# EAGLE schematic plusz-end-card-with-turnstile-mezzanine (EAGLE 9.6.2)

## Sheet 1 of 2: UHF
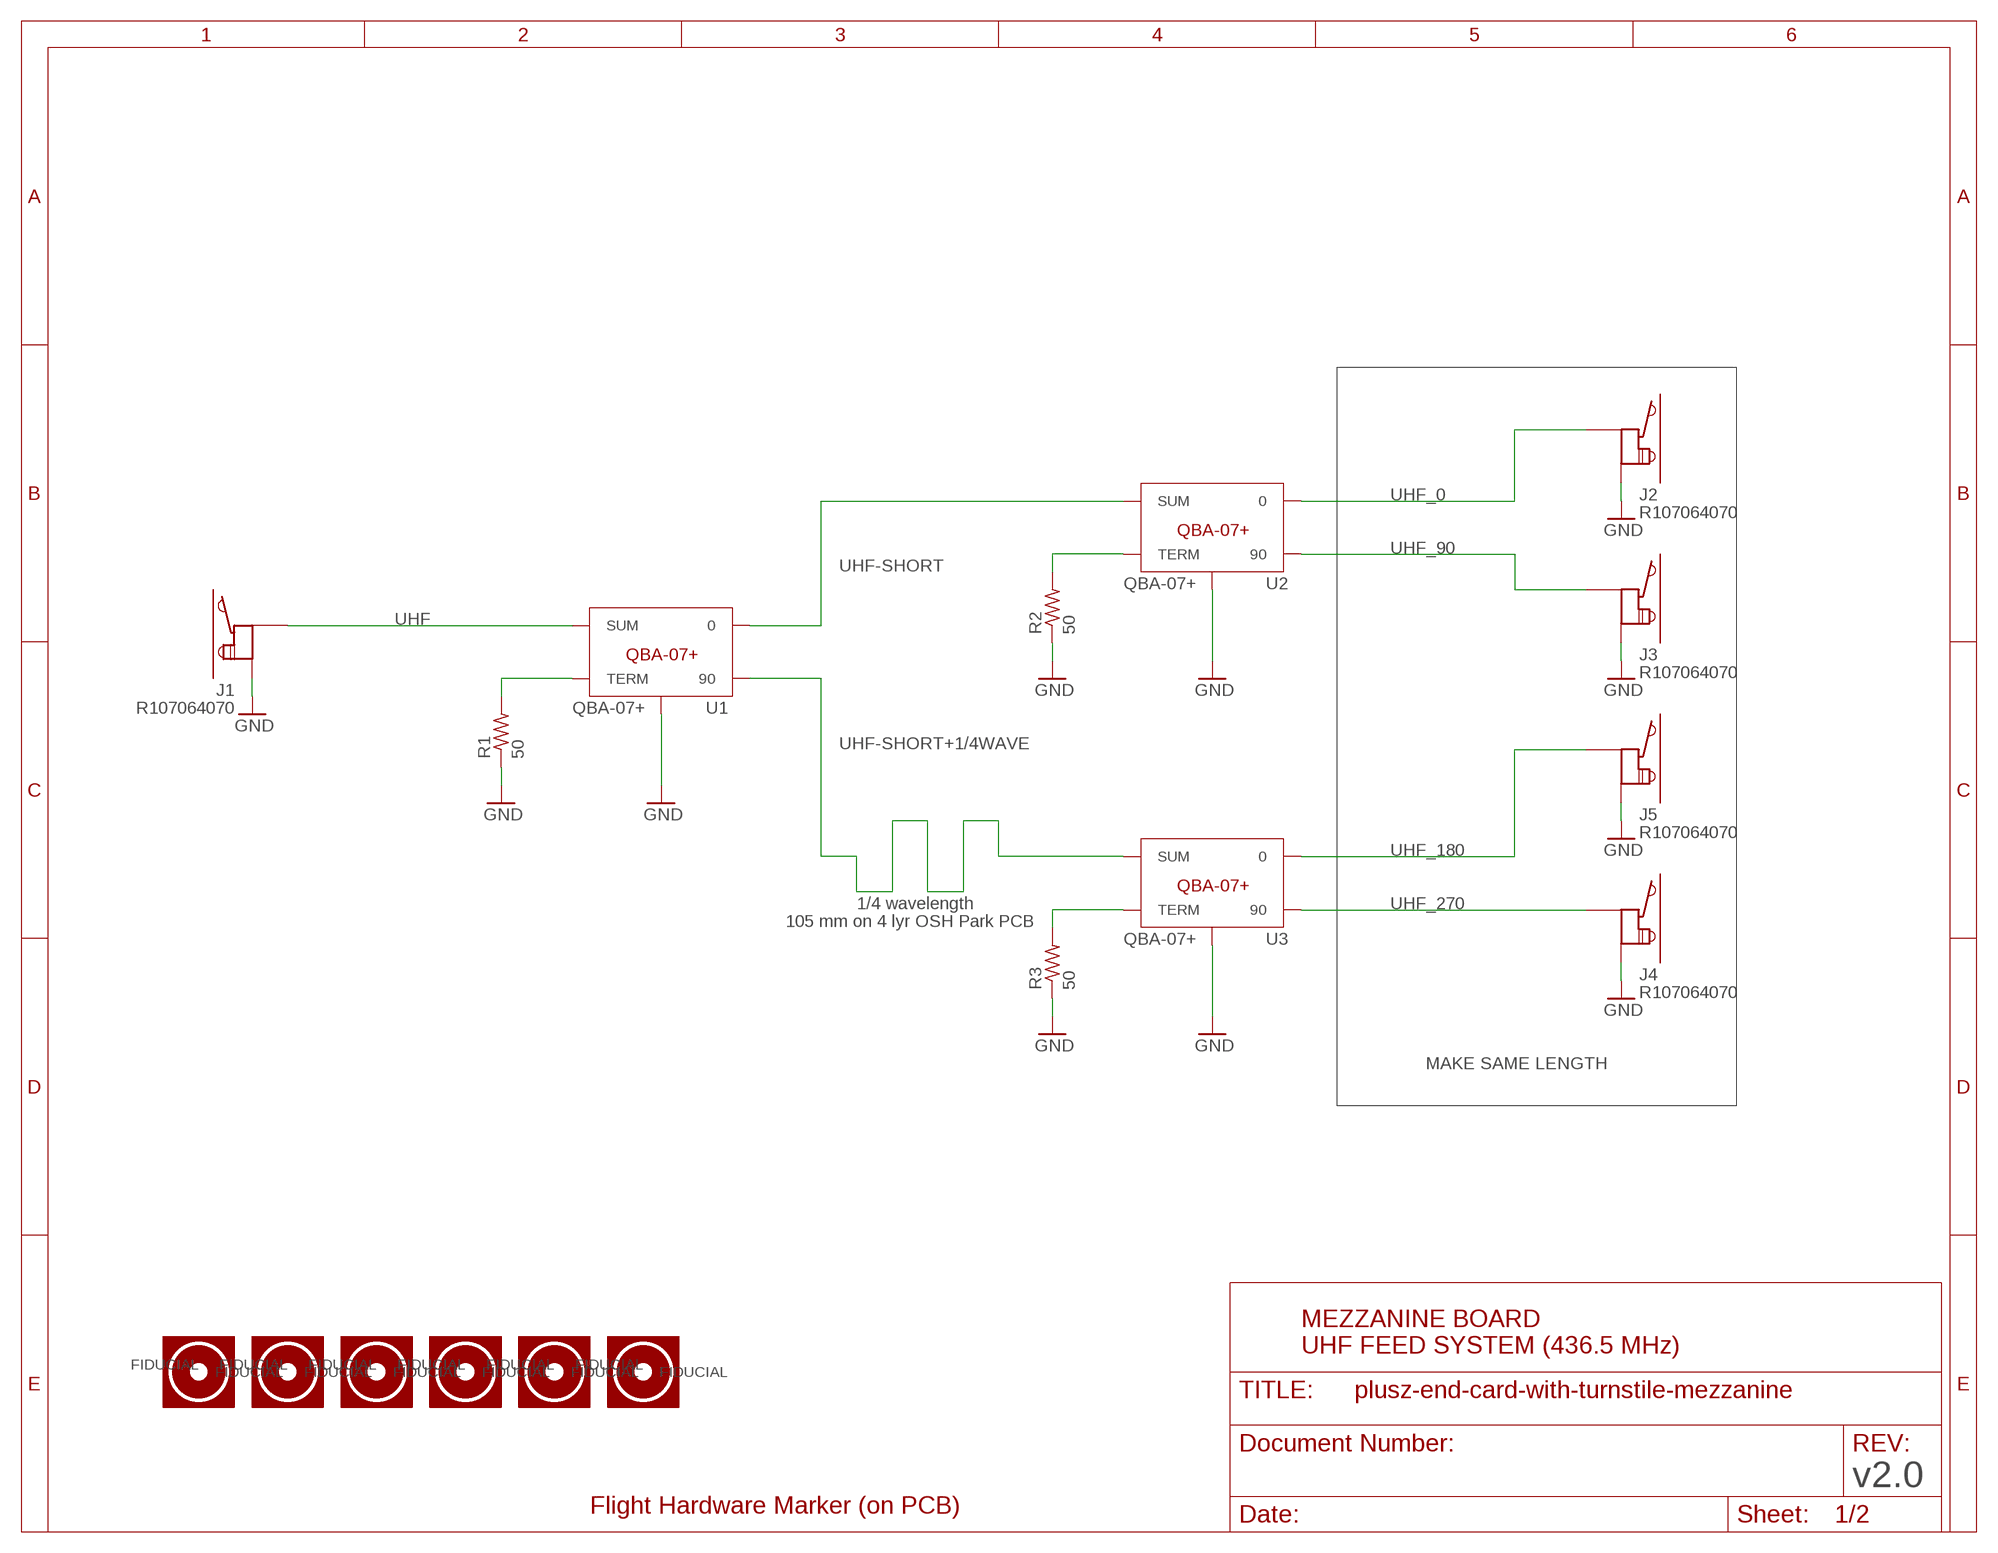
[diagram p0: schematic, sheet 1]

### Parts
FIDUCIAL1  FIDUCIAL-1.0X2.0  [FIDUCIAL-1.0X2.0]
FIDUCIAL2  FIDUCIAL-1.0X2.0  [FIDUCIAL-1.0X2.0]
FIDUCIAL3  FIDUCIAL-1.0X2.0  [FIDUCIAL-1.0X2.0]
FIDUCIAL4  FIDUCIAL-1.0X2.0  [FIDUCIAL-1.0X2.0]
FIDUCIAL6  FIDUCIAL-1.0X2.0  [FIDUCIAL-1.0X2.0]
FIDUCIAL7  FIDUCIAL-1.0X2.0  [FIDUCIAL-1.0X2.0]
J1  R107064070  [R107064070_SOLDER]
J2  R107064070  [R107064070_SOLDER]
J3  R107064070  [R107064070_SOLDER]
J4  R107064070  [R107064070_SOLDER]
J5  R107064070  [R107064070_SOLDER]
R1  50  R-US_0603-C-NOSILK  [.0603-C-NOSILK]
R2  50  R-US_0603-C-NOSILK  [.0603-C-NOSILK]
R3  50  R-US_0603-C-NOSILK  [.0603-C-NOSILK]
U1  QBA-07+  [QBA-07+]
U2  QBA-07+  [QBA-07+]
U3  QBA-07+  [QBA-07+]
U$1  FLIGHMARKERNEW  [FLIGHTMARKER_NEW_BOARDS]

### Nets
GND: J1.P$2 J1.P$3 J2.P$2 J2.P$3 J3.P$2 J3.P$3 J4.P$2 J4.P$3 J5.P$2 J5.P$3 R1.1 R2.1 R3.1 U1.2(GND) U1.3(GND) U1.4(GND) U1.7(GND) U1.8(GND) U1.9(GND) U1.GND-NO-PAD(GND) U2.2(GND) U2.3(GND) U2.4(GND) U2.7(GND) U2.8(GND) U2.9(GND) U2.GND-NO-PAD(GND) U3.2(GND) U3.3(GND) U3.4(GND) U3.7(GND) U3.8(GND) U3.9(GND) U3.GND-NO-PAD(GND) ; also sheet 2
N$3: R1.2 U1.5(TERM)
N$4: R2.2 U2.5(TERM)
N$6: R3.2 U3.5(TERM)
UHF [RF]: J1.P$1 U1.1(SUM)
UHF-SHORT [RF]: U1.6 U2.1(SUM)
UHF-SHORT+1/4WAVE [RF]: U1.10 U3.1(SUM)
UHF_0 [RF]: J2.P$1 U2.6
UHF_90 [RF]: J3.P$1 U2.10
UHF_180 [RF]: J5.P$1 U3.6
UHF_270 [RF]: J4.P$1 U3.10
Unconnected: FIDUCIAL1.FIDUCIAL FIDUCIAL2.FIDUCIAL FIDUCIAL3.FIDUCIAL FIDUCIAL4.FIDUCIAL FIDUCIAL6.FIDUCIAL FIDUCIAL7.FIDUCIAL

### Notes on the sheet
- 1/4 wavelength
- 105 mm on 4 lyr OSH Park PCB
- MAKE SAME LENGTH
- MEZZANINE BOARD
  UHF FEED SYSTEM (436.5 MHz)
- v2.0

## Sheet 2 of 2: L1 BAND
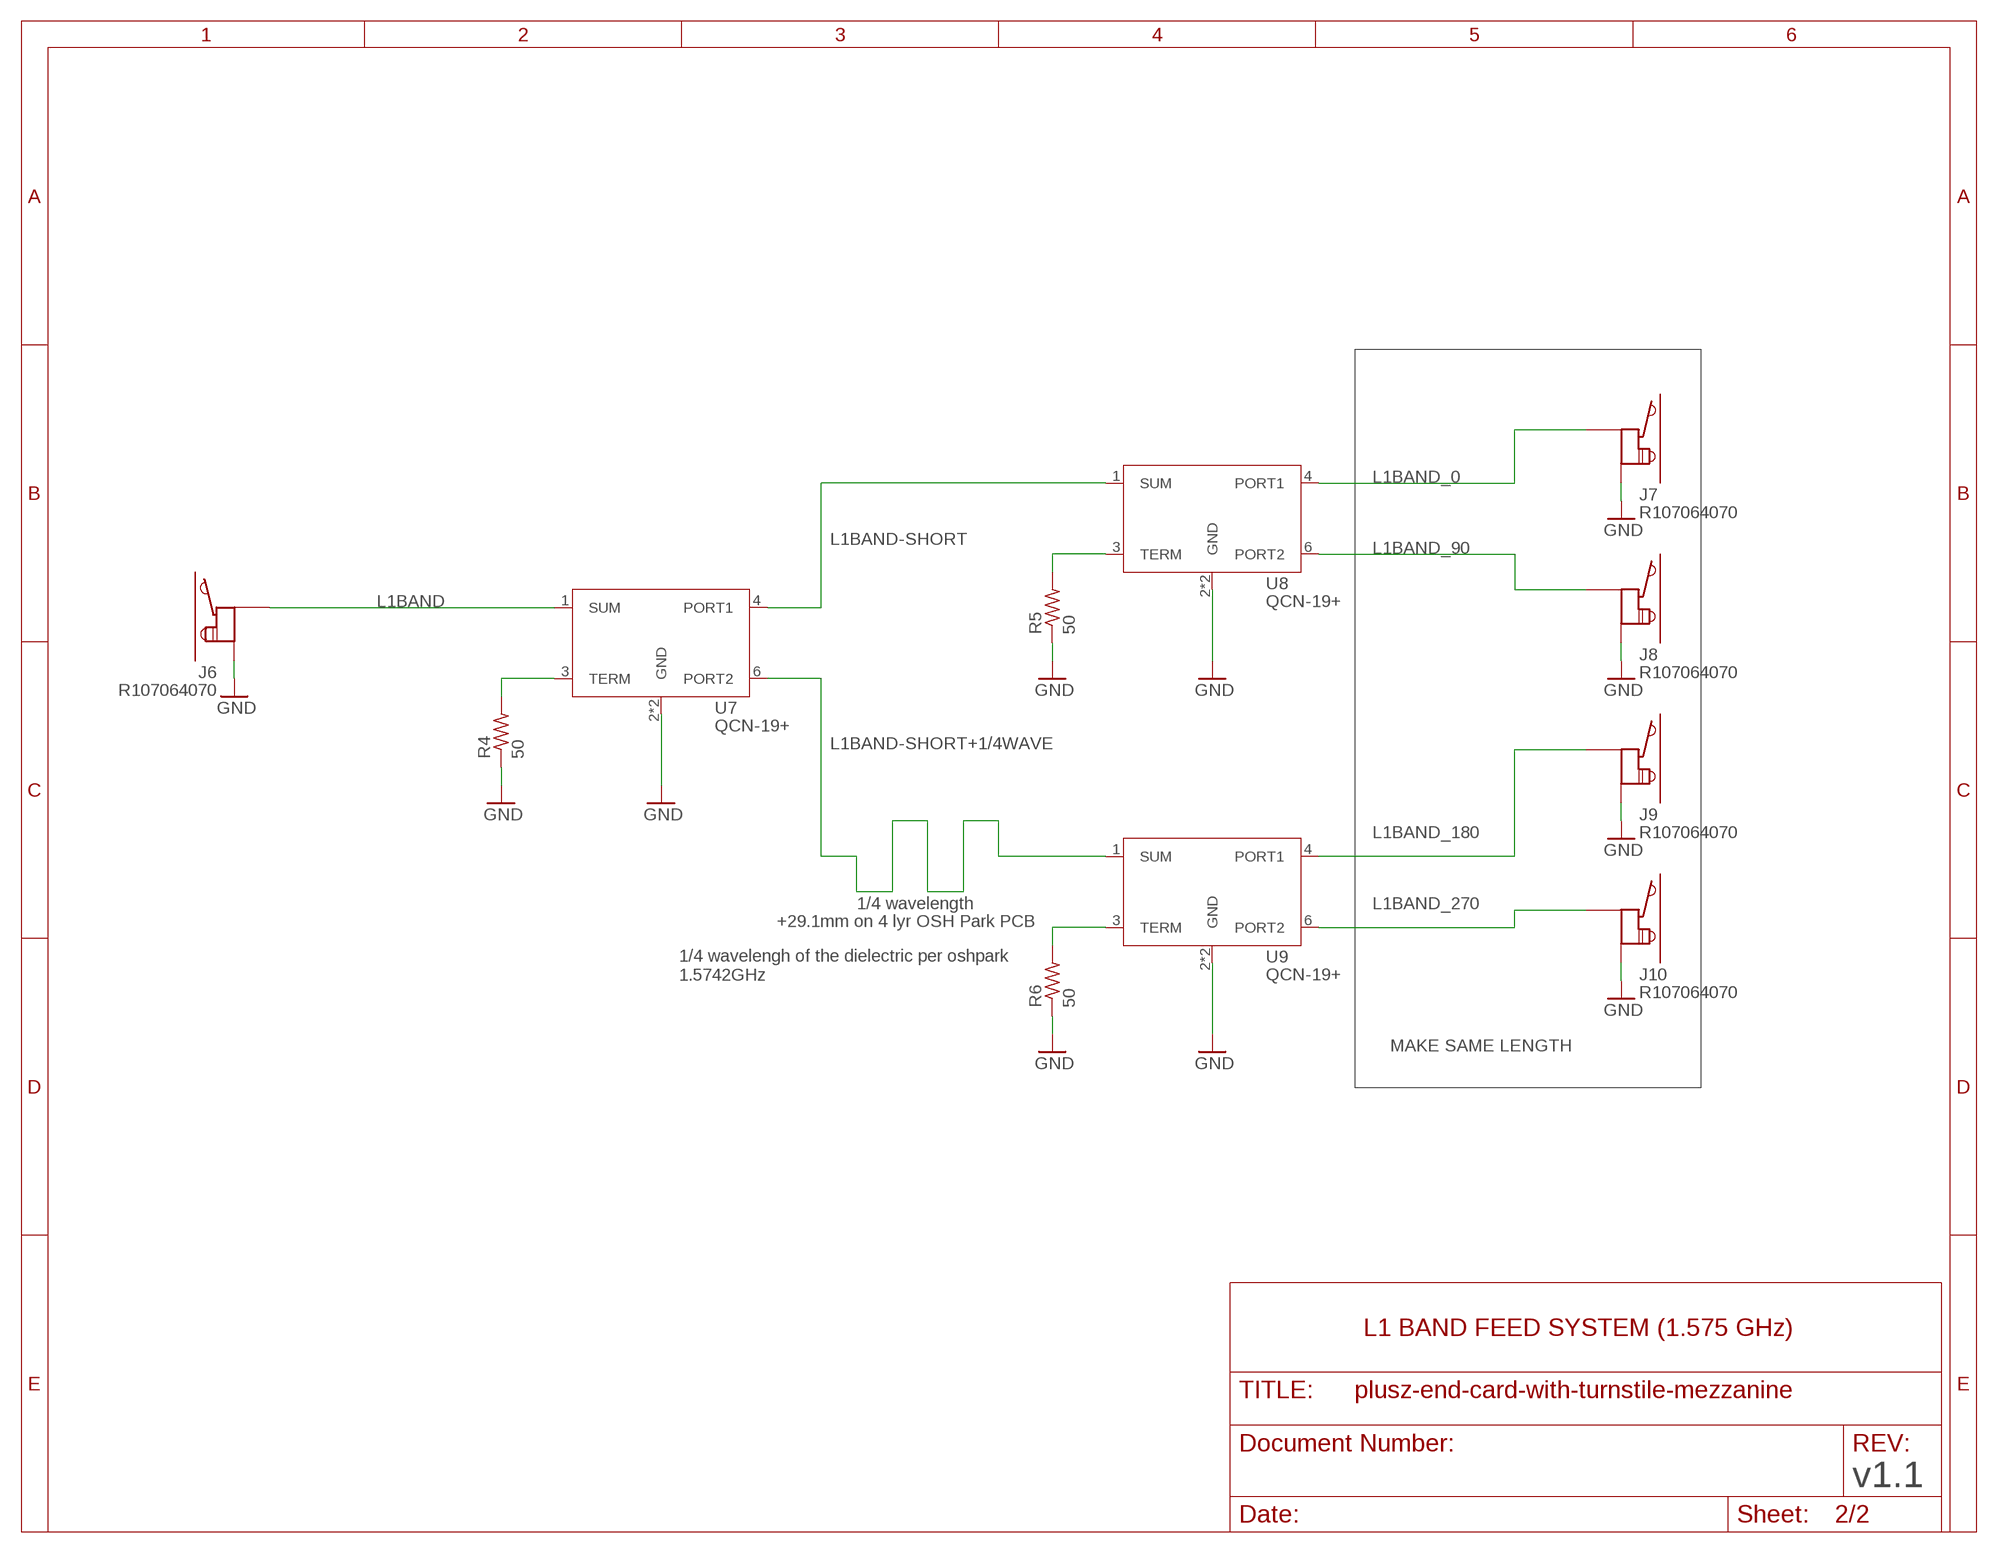
[diagram p1: schematic, sheet 2]

### Parts
J6  R107064070  [R107064070_SOLDER]
J7  R107064070  [R107064070_SOLDER]
J8  R107064070  [R107064070_SOLDER]
J9  R107064070  [R107064070_SOLDER]
J10  R107064070  [R107064070_SOLDER]
R4  50  R-US_0603-C-NOSILK  [.0603-C-NOSILK]
R5  50  R-US_0603-C-NOSILK  [.0603-C-NOSILK]
R6  50  R-US_0603-C-NOSILK  [.0603-C-NOSILK]
U7  QCN-19+  QCN-XXX+  [QCN-XXX+]
U8  QCN-19+  QCN-XXX+  [QCN-XXX+]
U9  QCN-19+  QCN-XXX+  [QCN-XXX+]

### Nets
GND: J6.P$2 J6.P$3 J7.P$2 J7.P$3 J8.P$2 J8.P$3 J9.P$2 J9.P$3 J10.P$2 J10.P$3 R4.1 R5.1 R6.1 U7.2(GND) U7.5(GND) U8.2(GND) U8.5(GND) U9.2(GND) U9.5(GND) ; also sheet 1
L1BAND [RF]: J6.P$1 U7.1(SUM)
L1BAND-SHORT [RF]: U7.4(PORT1) U8.1(SUM)
L1BAND-SHORT+1/4WAVE [RF]: U7.6(PORT2) U9.1(SUM)
L1BAND_0 [RF]: J7.P$1 U8.4(PORT1)
L1BAND_90 [RF]: J8.P$1 U8.6(PORT2)
L1BAND_180 [RF]: J9.P$1 U9.4(PORT1)
L1BAND_270 [RF]: J10.P$1 U9.6(PORT2)
N$1: R4.2 U7.3(TERM)
N$2: R5.2 U8.3(TERM)
N$5: R6.2 U9.3(TERM)

### Notes on the sheet
- 1/4 wavelength
- +29.1mm on 4 lyr OSH Park PCB
- 1/4 wavelengh of the dielectric per oshpark
  1.5742GHz
- MAKE SAME LENGTH
- L1 BAND FEED SYSTEM (1.575 GHz)
- v1.1

## Library data of the parts
FIDUCIAL1-FIDUCIAL4 FIDUCIAL6 FIDUCIAL7 = monitor-v2-debug:FIDUCIAL: Fiducials for optical coordinate reference
J1-J10 = J-Radiall-R107064070-RF:R107064070: Surface to surface low percision RF connector R107064070 Datasheet: Datasheet <https://www.mouser.com/datasheet/2/516/radiall_radls10120-1-1746158.pdf>; DESCRIPTION: Surface to surface RF connector; DIST: Mouser; DIST_PN: 501-R107064070; GENERIC: N; MFG: Radiall; MFG_PN: R107064070; P-NP: P
R1-R6 = oresat-rcl:R-US_: RESISTOR, American symbol
U1-U3 = U-MiniCirc-QBA-07+_Phase-shifter:QBA-07+
U7-U9 = U-MiniCirc-QCN-XXX+-quad:QCN-XXX+: RF Power Splitter/Combiner, Quadrature Hybrid QCN-19+ 1100 - 1925 MHz Datasheet: Datasheet <https://www.minicircuits.com/pdfs/QCN-19+.pdf>; DESCRIPTION: Signal Conditioning LTCC 90 Hybrid, 1100-1925 MHz, 50 ohms; DIST: Mouser; DIST_PN: 139-QCN-19; GENERIC: N; MFG: Mini-Circuits; MFG_PN: QCN-19+; P-NP: P
U$1 = oresat-flight-marker:FLIGHMARKER

## Net classes
1 RF: width 0.38 mm, drill 0.38 mm, clearance 1 mm